# EAGLE schematic klawiatura_Sony_ST120_v1 (EAGLE 6.6.0)
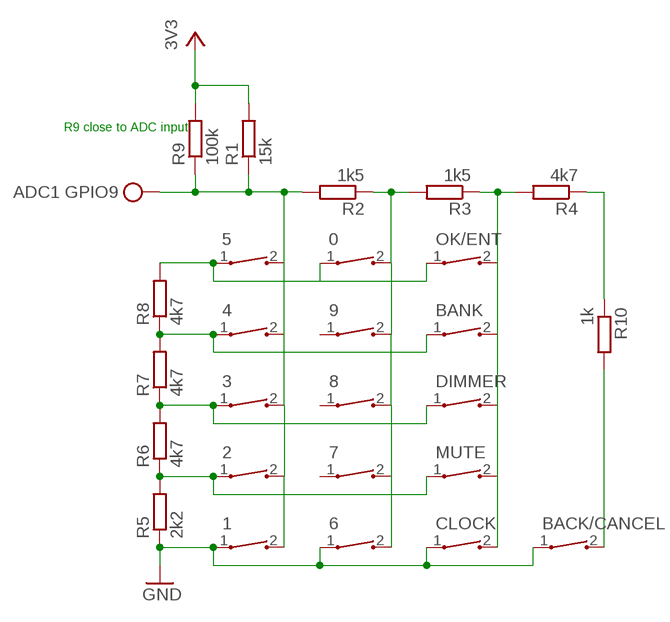
[diagram p0: schematic, sheet 1]

## Parts
0  CT10-XXXX-A2  [CT10-XXXX-A2]
1  CT10-XXXX-A2  [CT10-XXXX-A2]
2  CT10-XXXX-A2  [CT10-XXXX-A2]
3  CT10-XXXX-A2  [CT10-XXXX-A2]
4  CT10-XXXX-A2  [CT10-XXXX-A2]
5  CT10-XXXX-A2  [CT10-XXXX-A2]
6  CT10-XXXX-A2  [CT10-XXXX-A2]
7  CT10-XXXX-A2  [CT10-XXXX-A2]
8  CT10-XXXX-A2  [CT10-XXXX-A2]
9  CT10-XXXX-A2  [CT10-XXXX-A2]
BACK/CANCEL  CT10-XXXX-A2  [CT10-XXXX-A2]
BANK  CT10-XXXX-A2  [CT10-XXXX-A2]
CLOCK  CT10-XXXX-A2  [CT10-XXXX-A2]
DIMMER  CT10-XXXX-A2  [CT10-XXXX-A2]
MUTE  CT10-XXXX-A2  [CT10-XXXX-A2]
OK/ENT  CT10-XXXX-A2  [CT10-XXXX-A2]
R1  15k  R-EU_0204/5  [0204/5]
R2  1k5  R-EU_0204/5  [0204/5]
R3  1k5  R-EU_0204/5  [0204/5]
R4  4k7  R-EU_0204/5  [0204/5]
R5  2k2  R-EU_0204/5  [0204/5]
R6  4k7  R-EU_0204/5  [0204/5]
R7  4k7  R-EU_0204/5  [0204/5]
R8  4k7  R-EU_0204/5  [0204/5]
R9  100k  R-EU_0204/5  [0204/5]
R10  1k  R-EU_0204/5  [0204/5]

## Nets
GND: 1.1 6.1 BACK/CANCEL.1 CLOCK.1 R5.1
N$1: R4.1 R10.1
N$2: 0.2 6.2 7.2 8.2 9.2 R2.1 R3.2
N$4: 0.1 5.1 OK/ENT.1 R8.2
N$5: 4.1 BANK.1 R7.2 R8.1
N$6: 3.1 DIMMER.1 R6.2 R7.1
N$10: BANK.2 CLOCK.2 DIMMER.2 MUTE.2 OK/ENT.2 R3.1 R4.2
N$11: BACK/CANCEL.2 R10.2
N$12: 2.1 MUTE.1 R5.2 R6.1
VCC: 1.2 2.2 3.2 4.2 5.2 R1.1 R1.2 R2.2 R9.1 R9.2 ; supply symbol labelled 3V3, ADC1 GPIO9
Unconnected: 7.1 8.1 9.1

## Notes on the sheet
- R9 close to ADC input

## Library data of the parts
0 1-9 BACK/CANCEL BANK CLOCK DIMMER MUTE OK/ENT = switch-coto:CT10-XXXX-: CT10 Series Molded Switch Source: www.cotorelay.com .. Coto_Technology__CT10-1530-G1.pdf
R1-R10 = rcl:R-EU_: RESISTOR, European symbol